# EAGLE design pcb2 (EAGLE 9.6.0)
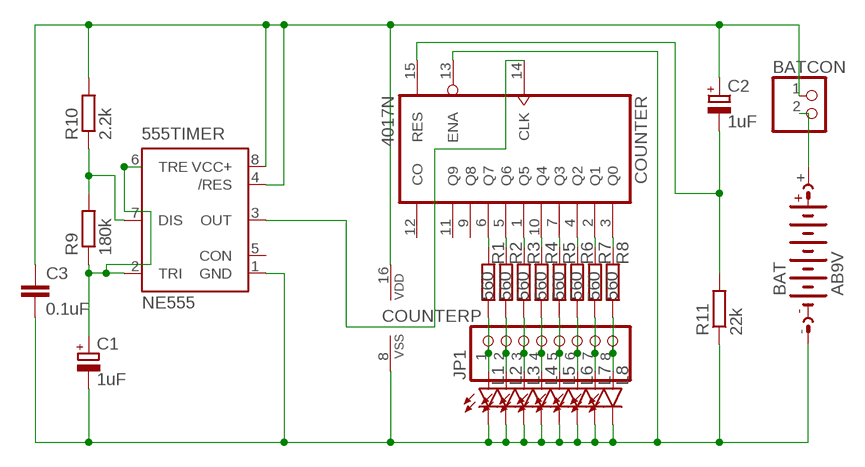
[diagram p0: schematic, sheet 1]

## Parts
555TIMER  NE555  [DIL-08]
BAT  AB9V  [AB9V]
BATCON  PINHD-1X2  [1X02]
C1  1uF  CPOL-EUE2.5-5  [E2,5-5]
C2  1uF  CPOL-EUE2.5-5  [E2,5-5]
C3  0.1uF  C-EU050-024X044  [C050-024X044]
COUNTER  4017N  [DIL16]
JP1  PINHD-1X8  [1X08]
L1  LED5MM  [LED5MM]
L2  LED5MM  [LED5MM]
L3  LED5MM  [LED5MM]
L4  LED5MM  [LED5MM]
L5  LED5MM  [LED5MM]
L6  LED5MM  [LED5MM]
L7  LED5MM  [LED5MM]
L8  LED5MM  [LED5MM]
R1  560  R-EU_0207/10  [0207/10]
R2  560  R-EU_0207/10  [0207/10]
R3  560  R-EU_0207/10  [0207/10]
R4  560  R-EU_0207/10  [0207/10]
R5  560  R-EU_0207/10  [0207/10]
R6  560  R-EU_0207/10  [0207/10]
R7  560  R-EU_0207/10  [0207/10]
R8  560  R-EU_0207/10  [0207/10]
R9  180k  R-EU_0207/10  [0207/10]
R10  2.2k  R-EU_0207/10  [0207/10]
R11  22k  R-EU_0207/10  [0207/10]

## Nets
N$1: JP1.2 L2.A R2.1
N$2: COUNTER.2(Q1) R7.2
N$3: C2.- COUNTER.15(RES) R11.2
N$4: BAT.+ BATCON.2
N$5: 555TIMER.3(OUT) COUNTER.14(CLK)
N$6: 555TIMER.4(/RES) 555TIMER.8(VCC+) BATCON.1 C2.+ C3.1 COUNTER.16(VDD) R10.2
N$7: 555TIMER.1(GND) BAT.- C1.- C3.2 COUNTER.8(VSS) COUNTER.13(ENA) L1.K(C) L2.K(C) L3.K(C) L4.K(C) L5.K(C) L6.K(C) L7.K(C) L8.K(C) R11.1
N$8: 555TIMER.7(DIS) R9.2 R10.1
N$9: COUNTER.6(Q7) R1.2
N$10: COUNTER.5(Q6) R2.2
N$11: 555TIMER.2(TRI) 555TIMER.6(TRE) C1.+ R9.1
N$12: COUNTER.1(Q5) R3.2
N$14: COUNTER.7(Q3) R5.2
N$15: COUNTER.4(Q2) R6.2
N$16: COUNTER.3(Q0) R8.2
N$17: JP1.1 L1.A R1.1
N$18: JP1.5 L5.A R5.1
N$19: JP1.3 L3.A R3.1
N$21: COUNTER.10(Q4) R4.2
N$22: JP1.6 L6.A R6.1
N$23: JP1.7 L7.A R7.1
N$24: JP1.8 L8.A R8.1
N$25: JP1.4 L4.A R4.1
Unconnected: 555TIMER.5(CON) COUNTER.9(Q8) COUNTER.11(Q9) COUNTER.12(CO)

## Library data of the parts
555TIMER = st-microelectronics:NE555: General purpose bipolar Timer; MF: Arrow Electronics; MPN: NE555N; OC_FARNELL: 1467742; OC_NEWARK: 89K1486
BAT = battery:AB9V: 9-V BATTERY CLIP
BATCON = pinhead:PINHD-1X2: PIN HEADER
C1 C2 = rcl:CPOL-EU: POLARIZED CAPACITOR, European symbol; SPICEPREFIX: C
C3 = rcl:C-EU: CAPACITOR, European symbol; SPICEPREFIX: C
COUNTER = 40xx:4017: COUNTER/DIVIDER
JP1 = pinhead:PINHD-1X8: PIN HEADER
L1-L8 = led:LED: LED OSRAM: - CHIPLED LG R971, LG N971, LY N971, LG Q971, LY Q971, LO R971, LY R971 LH N974, LH R974 LS Q976, LO Q976, LY Q976 LO Q996 - Hyper CHIPLED LW Q18S LB Q993, LB Q99A, LB R99A - SideLED LS A670, LO A670, LY A670, LG A670, LP A670 LB A673, LV A673, LT A673, LW A673 LH A674 LY A675 LS A676, LA A676, LO A676, LY A676, LW A676 LS A679, LY A679, LG A679 - Hyper Micro SIDELED® LS Y876, LA Y876, LO Y876, LY Y876 LT Y87S - SmartLED LW L88C, LW L88S LB L89C, LB L89S, LG L890 LS L89K, LO L89K, LY L89K LS L896, LA L896, LO L896, LY L896 - TOPLED LS T670, LO T670, LY T670, LG T670, LP T670 LSG T670, LSP T670, LSY T670, LOP T670, LYG T670 LG T671, LOG T671, LSG T671 LB T673, LV T673, LT T673, LW T673 LH T674 LS T676, LA T676, LO T676, LY T676, LB T676, LH T676, LSB T676, LW T676 LB T67C, LV T67C, LT T67C, LS T67K, LO T67K, LY T67K, LW E67C LS E67B, LA E67B, LO E67B, LY E67B, LB E67C, LV E67C, LT E67C LW T67C LS T679, LY T679, LG T679 LS T770, LO T770, LY T770, LG T770, LP T770 LB T773, LV T773, LT T773, LW T773 LH T774 LS E675, LA E675, LY E675, LS T675 LS T776, LA T776, LO T776, LY T776, LB T776 LHGB T686 LT T68C, LB T68C - Hyper Mini TOPLED® LB M676 - Mini TOPLED Santana® LG M470 LS M47K, LO M47K, LY M47K Source: http://www.osram.convergy.de LUXEON: - LUMILED® LXK2-PW12-R00, LXK2-PW12-S00, LXK2-PW14-U00, LXK2-PW14-V00 LXK2-PM12-R00, LXK2-PM12-S00, LXK2-PM14-U00 LXK2-PE12-Q00, LXK2-PE12-R00, LXK2-PE12-S00, LXK2-PE14-T00, LXK2-PE14-U00 LXK2-PB12-K00, LXK2-PB12-L00, LXK2-PB12-M00, LXK2-PB14-N00, LXK2-PB14-P00, LXK2-PB14-Q00 LXK2-PR12-L00, LXK2-PR12-M00, LXK2-PR14-Q00, LXK2-PR14-R00 LXK2-PD12-Q00, LXK2-PD12-R00, LXK2-PD12-S00 LXK2-PH12-R00, LXK2-PH12-S00 LXK2-PL12-P00, LXK2-PL12-Q00, LXK2-PL12-R00 Source: www.luxeon.com KINGBRIGHT: KA-3528ASYC Source: www.kingbright.com
R1-R11 = rcl:R-EU_: RESISTOR, European symbol; SPICEPREFIX: R

## Board
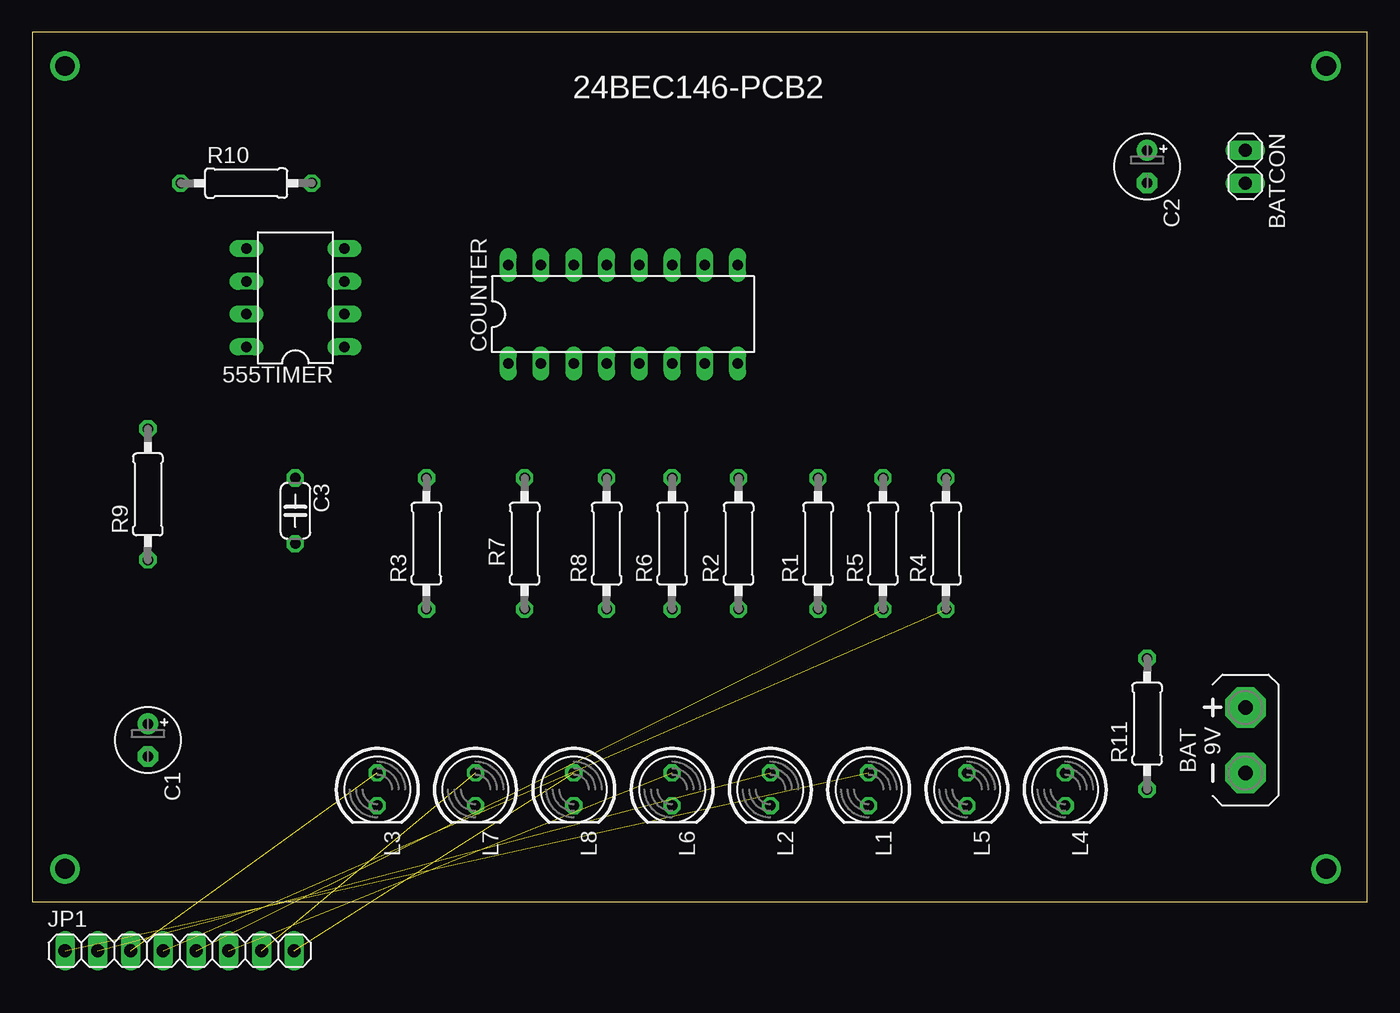
[diagram p1: board, top side]
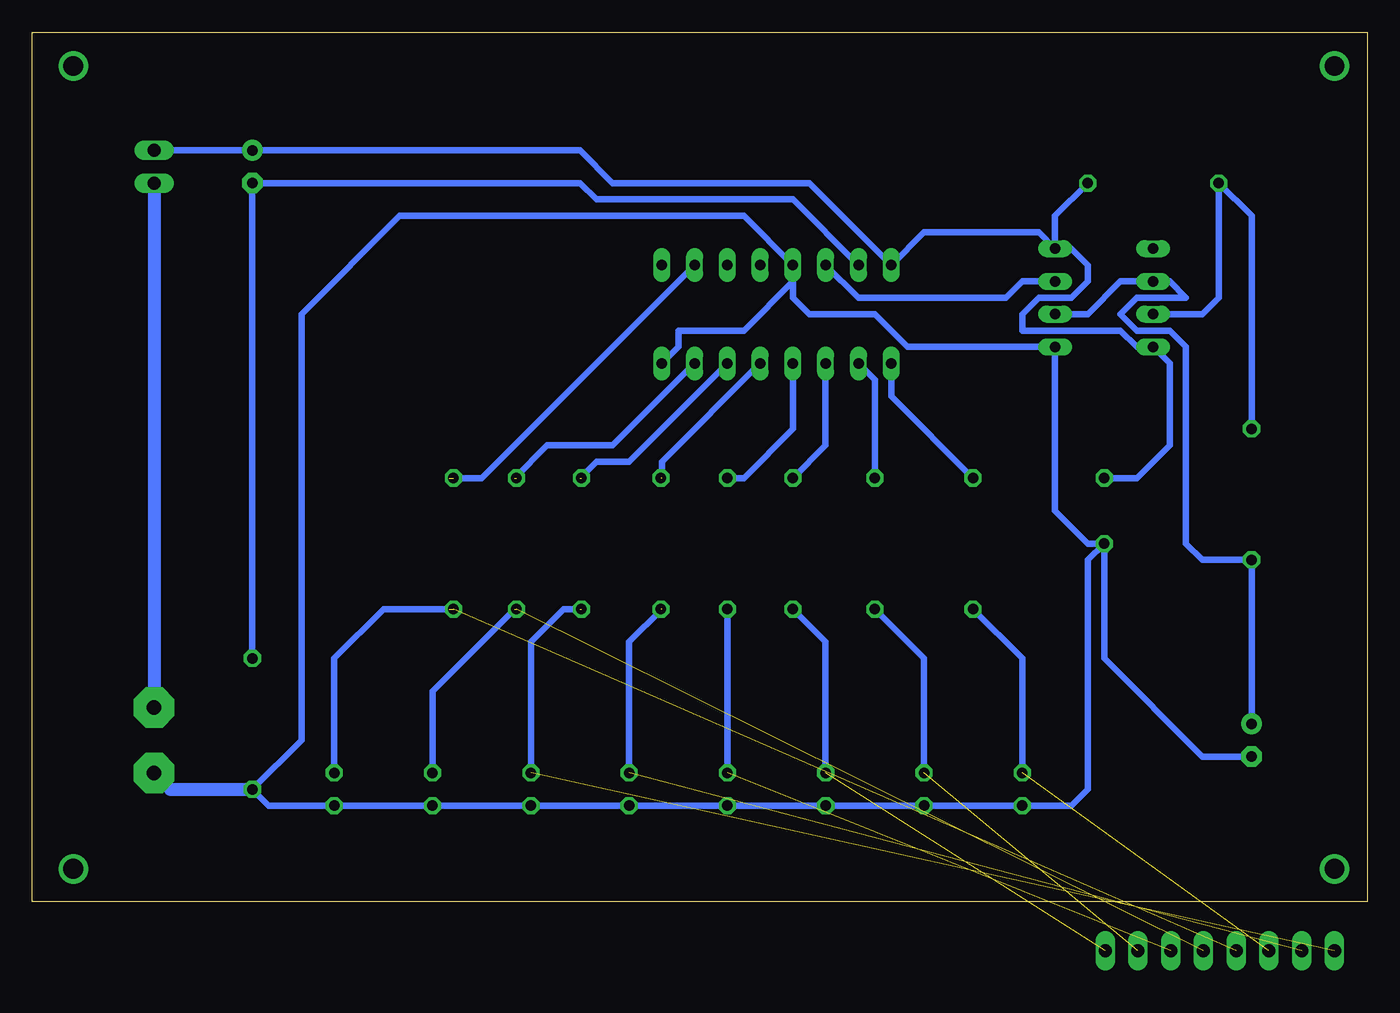
[diagram p2: board, bottom side, seen from below]

Size 103.51 x 67.38 mm. Coordinates in mm from the lower left corner, seen from the top.
Outline: 0,0 103.51,0 103.51,67.38 0,67.38 0,0
Copper layers (1*16): Top 0.035mm / dielectric 1.5mm / Bottom 0.035mm
Design rules "default": minimum track width 6mil, minimum drill 0.35mm, track to track 6mil, track to pad 6mil, pad to pad 6mil, via to via 6mil, smd to smd 6mil, copper to edge 40mil, drill to drill 6mil, minimum pad ring 10mil, minimum via ring 8mil, stop-mask expansion 4mil, vias tented up to drill 0mil, thermal gap 10mil

### Footprints (pad centres in the part's own frame; a part is rotated, then mirrored left to right if it is on the bottom)
DIL-08 = drill 0.813 long: 1 -3.81,-3.81; 2 -1.27,-3.81; 3 1.27,-3.81; 4 3.81,-3.81; 5 3.81,3.81; 6 1.27,3.81; 7 -1.27,3.81; 8 -3.81,3.81
AB9V = drill 1.118 pad 3.15 octagon: + 0,2.54; - 0,-2.54
1X02 = drill 1.016 long: 1 -1.27,0; 2 1.27,0
E2,5-5 = drill 0.813 pad 1.6: + -1.27,0 | drill 0.813 pad 1.6 octagon: - 1.27,0
C050-024X044 = drill 0.813 octagon: 1 -2.54,0; 2 2.54,0
DIL16 = drill 0.813 long: 1 -8.89,-3.81; 2 -6.35,-3.81; 3 -3.81,-3.81; 4 -1.27,-3.81; 5 1.27,-3.81; 6 3.81,-3.81; 7 6.35,-3.81; 8 8.89,-3.81; 9 8.89,3.81; 10 6.35,3.81; 11 3.81,3.81; 12 1.27,3.81; 13 -1.27,3.81; 14 -3.81,3.81; 15 -6.35,3.81; 16 -8.89,3.81
1X08 = drill 1.016 long: 1 -8.89,0; 2 -6.35,0; 3 -3.81,0; 4 -1.27,0; 5 1.27,0; 6 3.81,0; 7 6.35,0; 8 8.89,0
LED5MM = drill 0.813 octagon: A -1.27,0; K 1.27,0
0207/10 = drill 0.813 octagon: 1 -5.08,0; 2 5.08,0

### Placement (x,y rotation side)
555TIMER  20.4,46.8 90 top
BAT  94.06,12.51 0 top
BATCON  94.06,56.96 270 top
C1  8.97,12.51 270 top
C2  86.44,56.96 270 top
C3  20.4,30.29 270 top
COUNTER  45.8,45.53 0 top
JP1  11.43,-3.81 0 top  (outside the outline)
L1  64.85,8.7 270 top
L2  57.23,8.7 270 top
L3  26.75,8.7 270 top
L4  80.09,8.7 270 top
L5  72.47,8.7 270 top
L6  49.61,8.7 270 top
L7  34.37,8.7 270 top
L8  41.99,8.7 270 top
R1  60.93,27.75 90 top
R2  54.77,27.75 90 top
R3  30.56,27.75 90 top
R4  70.85,27.75 90 top
R5  65.96,27.75 90 top
R6  49.61,27.75 90 top
R7  38.18,27.75 90 top
R8  44.53,27.75 90 top
R9  8.97,31.56 90 top
R10  16.59,55.69 0 top
R11  86.44,13.78 90 top

### Tracks (layer width: path | path; a pad name or v marks a point on that pad's centre or on a via)
N$1  (2 unrouted)
  Bottom 0.508: L2.A 57.23,20.13 54.69,22.67
N$2
  Bottom 0.508: COUNTER.2 38.18,40.45 R7.2
N$3
  Bottom 0.508: R11.2 C2.- 61.04,55.69 59.77,54.42 44.53,54.42 COUNTER.15
N$4
  Bottom 1.016: BATCON.2 BAT.+
N$5
  Bottom 0.508: 555TIMER.3 26.75,48.07 28.02,46.8 39.45,46.8 COUNTER.14
N$6
  Bottom 0.508: BATCON.1 C2.+ 61.04,58.23 58.5,55.69 43.26,55.69 COUNTER.16 34.37,51.88 25.48,51.88 555TIMER.4 | R10.2 24.21,53.15 555TIMER.4 | C3.1 17.86,32.83 15.32,35.37 15.32,41.72 555TIMER.8 17.86,42.99 19.13,44.26 26.75,44.26 26.75,45.53 25.48,46.8 22.94,46.8 21.67,48.07 21.67,49.34 22.94,50.61 555TIMER.4
N$7
  Bottom 0.508: C1.- 12.78,11.24 20.4,18.86 C3.2 | C3.2 21.67,27.75 24.21,30.29 555TIMER.1 35.64,42.99 38.18,45.53 43.26,45.53 44.53,46.8 COUNTER.13 | COUNTER.13 48.34,53.15 75.01,53.15 82.63,45.53 82.63,12.51 R11.1 85.17,7.43 L4.K L5.K L1.K L2.K L6.K L8.K L7.K L3.K 22.94,7.43 21.67,8.7 21.67,26.48 C3.2 | COUNTER.13 44.53,48.07 48.34,44.26 53.42,44.26 53.42,42.99 COUNTER.8
  Bottom 1.016: R11.1 92.79,8.7 BAT.-
N$8
  Bottom 0.508: 555TIMER.7 12.78,45.53 11.51,46.8 R10.1 8.97,53.15 R9.2
N$9  (1 unrouted)
  Bottom 0.508: COUNTER.6 57.23,34.1 59.77,34.1 61.04,32.83
N$10  (1 unrouted)
  Bottom 0.508: COUNTER.5 54.69,34.1 54.69,32.83
N$11
  Bottom 0.508: C1.+ R9.1 12.78,26.48 14.05,27.75 14.05,42.99 15.32,44.26 17.86,44.26 19.13,45.53 17.86,46.8 14.05,46.8 15.32,48.07 555TIMER.6 19.13,48.07 21.67,45.53 555TIMER.2
N$12
  Bottom 0.508: R3.2 36.91,39.18 COUNTER.1
N$13  (via drill 1.52)
  other vias: 2.54,64.77
N$14  (1 unrouted)
  Bottom 0.508: COUNTER.7 58.5,35.37 63.58,35.37 66.12,32.83
N$15
  Bottom 0.508: R6.2 48.34,32.83 44.53,36.64 COUNTER.4
N$16
  Bottom 0.508: COUNTER.3 41.99,35.37 R8.2
N$17  (2 unrouted)
  Bottom 0.508: L1.A 64.85,20.13 62.31,22.67 61.04,22.67
N$18  (2 unrouted)
  Bottom 0.508: L5.A 72.47,16.32 66.12,22.67
N$19  (1 unrouted)
  Bottom 0.508: R3.1 26.75,18.86 L3.A
N$20  (via drill 1.52)
  other vias: 2.54,2.54
N$21  (1 unrouted)
  Bottom 0.508: COUNTER.10 68.66,32.83 71.2,32.83
N$22  (1 unrouted)
  Bottom 0.508: R6.1 L6.A
N$23  (1 unrouted)
  Bottom 0.508: R7.1 34.37,18.86 L7.A
N$24  (1 unrouted)
  Bottom 0.508: R8.1 41.99,20.13 L8.A
N$25  (2 unrouted)
  Bottom 0.508: L4.A 80.09,18.86 76.28,22.67 71.2,22.67
N$26  (via drill 1.52)
  other vias: 100.33,64.77
N$27  (via drill 1.52)
  other vias: 100.33,2.54

### Text on the board
tPlace: 24BEC146-PCB2